# Altium schematic sheet PAGE118.SchDoc
size 246 x 182 mm
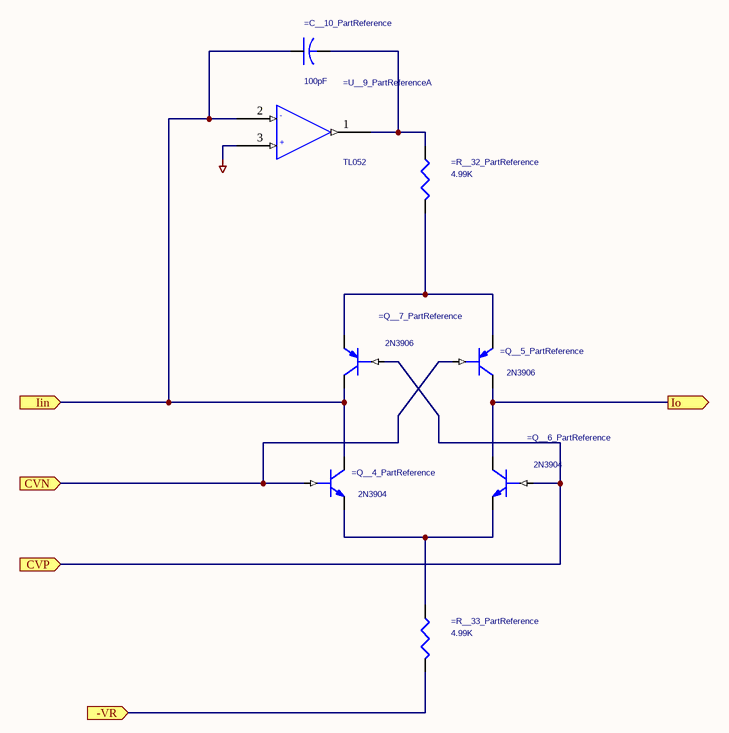
[diagram p0: PAGE118.SchDoc]

## Parts
=C__10_PartReference  100pF  [RAD0.1]
=Q__4_PartReference  2N3904  [TO92]
=Q__5_PartReference  2N3906  [TO92]
=Q__6_PartReference  2N3904  [TO92]
=Q__7_PartReference  2N3906  [TO92]
=R__32_PartReference  4.99K  [AXIAL0.4]
=R__33_PartReference  4.99K  [AXIAL0.4]
=U__9_PartReference  TL052  [DIP8]  (part A of 3)

## Ports
-VR (in), CVN (in), CVP (in), Iin (in), Io (out)

## Nets
AGND: =U__9_PartReference.3(+)
-VR: =R__33_PartReference.2 ; port -VR
CVN: =Q__4_PartReference.BASE =Q__5_PartReference.BASE ; port CVN
CVP: =Q__6_PartReference.BASE =Q__7_PartReference.BASE ; port CVP
Iin: =C__10_PartReference.1 =Q__4_PartReference.COLLECTOR =Q__7_PartReference.COLLECTOR =U__9_PartReference.2(-) ; port Iin
Io: =Q__5_PartReference.COLLECTOR =Q__6_PartReference.COLLECTOR ; port Io
Net=C__10_PartReference_2: =C__10_PartReference.2 =R__32_PartReference.1 =U__9_PartReference.1(OUT)
Net=Q__4_PartReference_EMITTER: =Q__4_PartReference.EMITTER =Q__6_PartReference.EMITTER =R__33_PartReference.1
Net=Q__5_PartReference_EMITTER: =Q__5_PartReference.EMITTER =Q__7_PartReference.EMITTER =R__32_PartReference.2

## Library data of the parts
=C__10_PartReference = CAP_Dup1
=Q__4_PartReference =Q__6_PartReference = NPN
=Q__5_PartReference =Q__7_PartReference = PNP
=R__32_PartReference =R__33_PartReference = R_Dup1: MOUSER PN: 271-4.99K-RC
=U__9_PartReference = GEN DUAL OPAMP-H: PACKAGE: =U__9_PACKAGE